# Altium project SIM_V2.PrjPCB
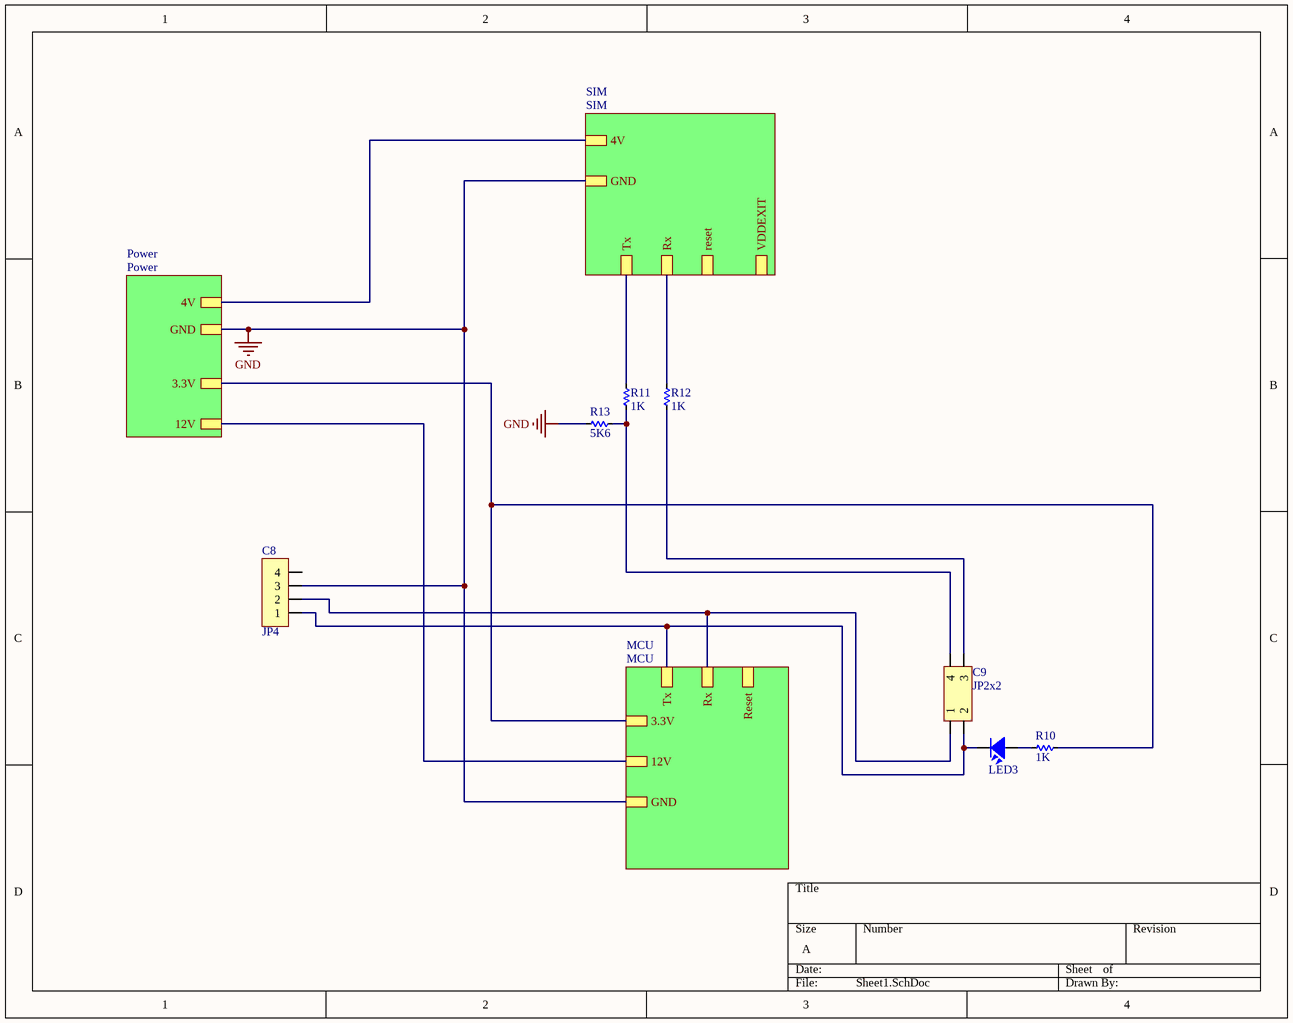
[diagram p0: Sheet1.SchDoc]
3 sheets, 38 parts. Net scope: hierarchical (ports join the sheet entries above them; power ports are global).
Board file: SIm800C-V2.PcbDoc
Sheets:
  Sheet1.SchDoc
    Power = Power.SchDoc
    MCU = MCU.SchDoc

## Sheet Sheet1.SchDoc
size A

### Parts
(Parts that share a designator on the sheet are numbered #1, #2 ... from top to bottom, then left to right.)
C8  JP4  [JP4-C1T]
C9  JP2x2  [JP2-D2T]
LED3  LED  [LED-0805-Green]  (value not drawn)
R10#1  1K  [RES-SMD-0805]
R11  1K  [RES-SMD-0805]
R12  1K  [RES-SMD-0805]
R13  5K6  [RES-SMD-0805]

### Sub-sheets
MCU = MCU: 3.3V, GND, Tx, Rx, Reset, 12V
Power = Power: 4V, GND, 3.3V, 12V
SIM = SIM (file not in this document): 4V, GND, Tx, Rx, reset, VDDEXIT

### Nets
GND: C8.3 R13.2 ; sheet Power/GND, sheet SIM/GND, sheet MCU/GND
NetC1_1: sheet Power/12V, sheet MCU/12V
NetC3_1: R10#1.2 ; sheet Power/3.3V, sheet MCU/3.3V
NetC8_1: C8.1 C9.2 LED3.2 ; sheet MCU/Tx
NetC8_2: C8.2 C9.1 ; sheet MCU/Rx
NetC9_3: C9.3 R12.2
NetC9_4: C9.4 R11.2 R13.1
NetJ?_2: sheet Power/4V, sheet SIM/4V
NetLED3_1: LED3.1 R10#1.1
NetR11_1: R11.1 ; sheet SIM/Tx
NetR12_1: R12.1 ; sheet SIM/Rx

Not connected (* = marked no-connect by the designer): C8 4

### Library data of the parts
C8 = JP4: WR-PHD 2.54 mm Angled Socket Header; Manufacturer: W¨¹rth Elektronik eiSos GmbH; partNo: 613004143121; ComponentLink1 Description: Manufacturer; ComponentLink2 Description: Datasheet; NoPins: 04; Created Date: 29 March 2013; ComponentLink1URL: http://www.we-online.com; ComponentLink2URL: http://katalog.we-online.de/em/datasheet/6130xx143121.pdf; Created by: Karrer Zheng
C9 = JP2x2: WR-PHD 2.54 mm Dual Socket Header; Manufacturer: W¨¹rth Elektronik eiSos GmbH; partNo: 61300421821; ComponentLink1 Description: Manufacturer; ComponentLink2 Description: Datasheet; NoPins: 04; Created Date: 29 March 2013; ComponentLink1URL: http://www.we-online.com; ComponentLink2URL: http://katalog.we-online.de/em/datasheet/6130xx21821.pdf; Created by: Karrer Zheng
LED3 = LED SMD: Value: LED 3 - 5 ly 2 Colour
R10#1 R11-R13 = Res-SMD: Resistor; Manufacturer: Generic Components; Class: Passive; Published: 08/06/2000; Publisher: Altium Hobart Technology Centre

## Sheet Power.SchDoc
size A
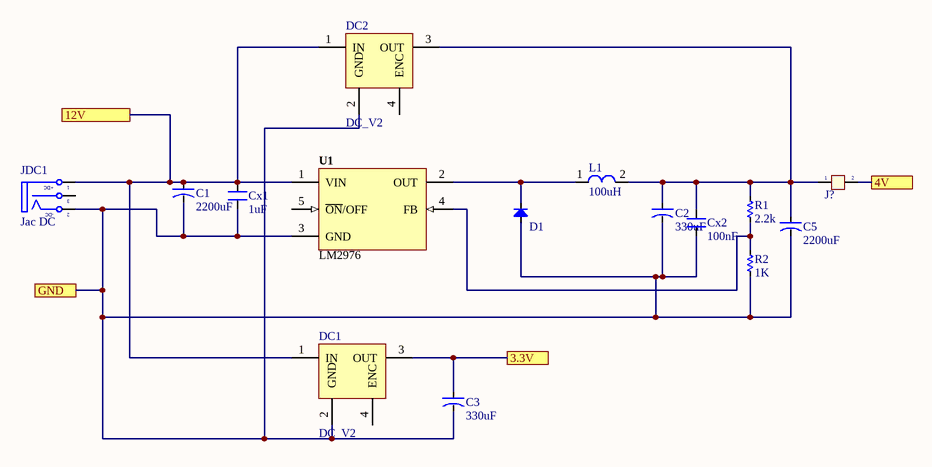
[diagram p1: Power.SchDoc]

### Parts
C1  2200uF  [CA-ALU-5]
C2  330uF  [CA-ALU-5]
C3  330uF  [CA-ALU-5]
C5  2200uF  [CA-ALU-5]
Cx1  1uF  [CN-SMD-0805]
Cx2  100nF  [CN-SMD-0805]
D1  MBR340  [DIO-5AN]  (value not drawn)
DC1  DC_V2  [DC_V2]
DC2  DC_V2  [DC_V2]
J?  Jumper 2  [JP2]  (value not drawn)
JDC1  Jac DC  [DC0]
L1  100uH  [L-SMD-M-12x10]
R1  2.2k  [RES-SMD-0805]
R2  1K  [RES-SMD-0805]
U1  LM2976  [TO263]

### Ports
3.3V, 4V, 12V, GND

### Nets
GND: C1.2 C2.2 C3.2 C5.2 Cx1.1 Cx2.1 D1.1(A) DC1.2(GND) DC2.2(GND) JDC1.2(TN) R2.2 U1.3(GND) ; port GND
NetC1_1: C1.1 Cx1.2 DC1.1(IN) DC2.1(IN) JDC1.1(T) U1.1(VIN) ; port 12V
NetC2_1: C2.1 C5.1 Cx2.2 DC2.3(OUT) J?.1 L1.2 R1.1
NetC3_1: C3.1 DC1.3(OUT) ; port 3.3V
NetD1_2: D1.2(K) L1.1 U1.2(OUT)
NetJ?_2: J?.2 ; port 4V
NetR1_2: R1.2 R2.1 U1.4(FB)

Not connected (* = marked no-connect by the designer): DC1 4(ENC); DC2 4(ENC); JDC1 3(S); U1 5(~{ON}/OFF)

### Notes on the sheet
- (in symbol DCIN) +DC; -DC

### Library data of the parts
C1-C3 C5 = CN-ALU-DIP: Capacitor (Semiconductor SIM Model); Value: 104; LatestRevisionDate: 17-Jul-2002; LatestRevisionNote: Re-released for DXP Platform.; PackageReference: C1206; Publisher: Altium Limited
Cx1 Cx2 = CN: Value: 33pF
D1 = Diode: Default Diode; Code - JEDEC: DO-214-AB; Value: 1N5007; Published: 8-Jun-2000; Revision: July-2002: Re-released for DXP Platform.; Publisher: Altium Limited
DC1 DC2 = DC_Module_V2
J? = JP 2: Value: JP 2
JDC1 = DCIN: Jac DC input; Value: Jac DC
L1 = L-SMD-1: partNo: 78477010; Manufacturer: Wurth Elektronik; Inductance: 1.0 μH; ComponentLink1Description: Manufacturer; ComponentLink1URL: http://www.we-online.de; Created by: Baojun Chen; Created Date: Nov.2015; ComponentLink2Description: Datasheet; ComponentLink2URL: http://katalog.we-online.de/pbs/datasheet/78477010.pdf
R1 R2 = Res-SMD: as R10#1 on sheet Sheet1; Published: 08/06/2000; Publisher: Altium Hobart Technology Centre
U1 = LM2596: Max Input Voltage: 12 V; Max Output Current: 3 (6.0 peak) A; Max Output Voltage: mV; Category: IC-Power; Min Input Voltage: mV; Min Output Voltage: mV; Mounting Technology: Surface Mount; Status: Unreleased; Supply Voltage: mV; Temperature Range: -40 to +125 degC

## Sheet MCU.SchDoc
size A
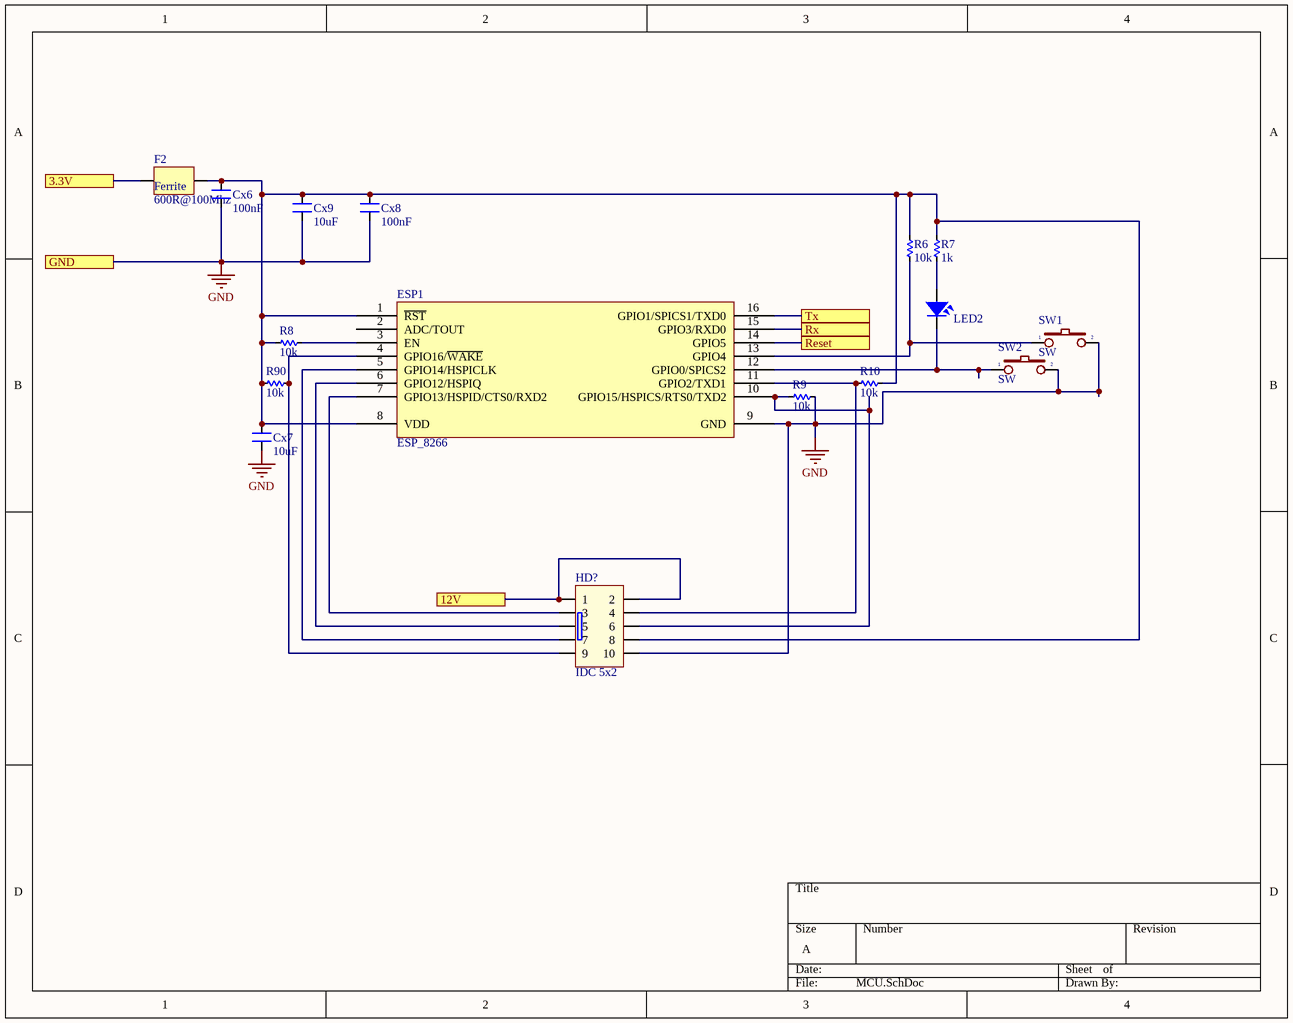
[diagram p2: MCU.SchDoc]

### Parts
(Parts that share a designator on the sheet are numbered #1, #2 ... from top to bottom, then left to right.)
Cx6  100nF  [CN-SMD-0805]
Cx7  10uF  [CN-SMD-0805]
Cx8  100nF  [CN-SMD-0805]
Cx9  10uF  [CN-SMD-0805]
ESP1  ESP_8266  [ESP12_small]
F2  600R@100Mhz  [Capacitor_805]
HD?  IDC 5x2  [IDC10-BH]
LED2  LED  [LED-0805-Green]  (value not drawn)
R6  10k  [RES-SMD-0805]
R7  1k  [RES-SMD-0805]
R8  10k  [RES-SMD-0805]
R9  10k  [RES-SMD-0805]
R10#2  10k  [RES-SMD-0805]
R90  10k  [RES-SMD-0805]
SW1  SW  [SW1-DIP]
SW2  SW  [SW1-SMD]

### Ports
3.3V, 12V, GND, Reset, Rx, Tx

### Nets
GND: Cx6.1 Cx7.2 Cx8.1 Cx9.1 ESP1.9(GND) HD?.10 R9.1 SW1.2 SW2.2 ; port GND
NetC1_1: HD?.1 HD?.2 ; port 12V
NetC3_1: F2.1 ; port 3.3V
NetC8_1: ESP1.16(GPIO1/SPICS1/TXD0) ; port Tx
NetC8_2: ESP1.15(GPIO3/RXD0) ; port Rx
NetCx6_2: Cx6.2 Cx7.1 Cx8.2 Cx9.2 ESP1.1(~{RST}) ESP1.8(VDD) F2.2 HD?.8 R6.1 R7.1 R8.2 R10#2.1 R90.2
NetESP1_3: ESP1.3(EN) R8.1
NetESP1_4: ESP1.4(GPIO16/~{WAKE}) HD?.9 R90.1
NetESP1_5: ESP1.5(GPIO14/HSPICLK) HD?.7
NetESP1_6: ESP1.6(GPIO12/HSPIQ) HD?.5
NetESP1_7: ESP1.7(GPIO13/HSPID/CTS0/RXD2) HD?.3
NetESP1_10: ESP1.10(GPIO15/HSPICS/RTS0/TXD2) HD?.6 R9.2
NetESP1_11: ESP1.11(GPIO2/TXD1) HD?.4 R10#2.2
NetESP1_12: ESP1.12(GPIO0/SPICS2) LED2.2 SW2.1
NetESP1_13: ESP1.13(GPIO4) R6.2 SW1.1
NetESP1_14: ESP1.14(GPIO5) ; port Reset
NetLED2_1: LED2.1 R7.2

Not connected (* = marked no-connect by the designer): ESP1 2(ADC/TOUT)

### Library data of the parts
Cx6-Cx9 = CN: Value: 33pF
F2 = Ferrite
HD? = IDC 5X2: Value: Header 5x2
LED2 = LED SMD: Value: LED 3 - 5 ly 2 Colour
R6-R9 R10#2 R90 = Res-SMD: as R10#1 on sheet Sheet1; Published: 08/06/2000; Publisher: Altium Hobart Technology Centre
SW1 SW2 = SW2: Switch button 2 pin; Value: SW chip 2 pin

## Nets that join several sheets
GND: Sheet1 (C8.3 R13.2), Power (12 pins), MCU (9 pins)
NetC1_1: Power (6 pins), MCU (HD?.1 HD?.2)
NetC3_1: Sheet1 (R10#1.2), Power (C3.1 DC1.3), MCU (F2.1)
NetC8_1: Sheet1 (C8.1 C9.2 LED3.2), MCU (ESP1.16)
NetC8_2: Sheet1 (C8.2 C9.1), MCU (ESP1.15)